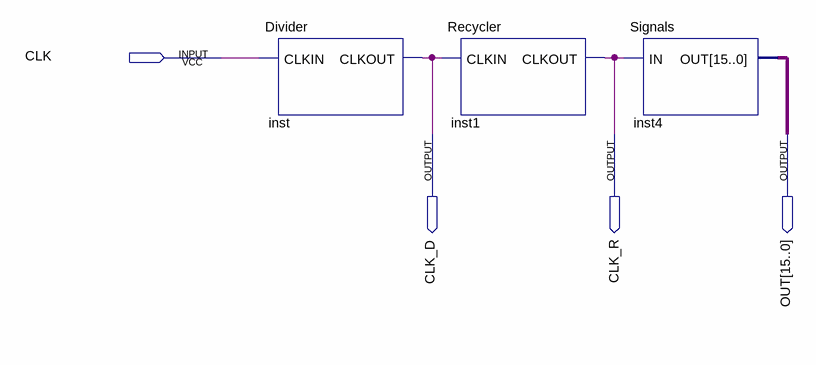
[diagram p0: schematic sheet]
// Quartus schematic Generator.bdf as structural Verilog: 3 symbols, 4 pins
module Generator (
  input  CLK,
  output CLK_D,
  output CLK_R,
  output [15:0] OUT
);

  Divider inst (.CLKIN(CLK), .CLKOUT(CLK_D));
  Recycler inst1 (.CLKIN(CLK_D), .CLKOUT(CLK_R));
  Signals inst4 (.IN(CLK_R), .OUT(OUT));
endmodule
